# Altium project hv_psu_v100.PrjPcb
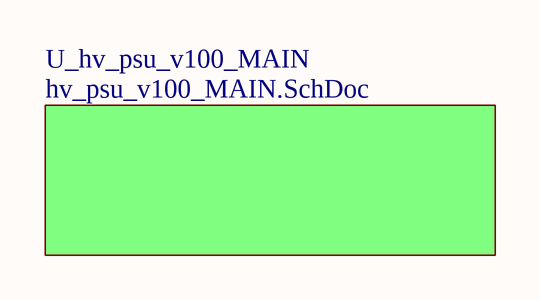
[diagram p0: hv_psu_v100_FRP.SchDoc]
7 sheets, 106 parts. Net scope: flat (ports and power ports of the same name join across sheets).
Board file: hv_psu_v100.PcbDoc
Sheets:
  hv_psu_v100_FRP.SchDoc
    U_hv_psu_v100_MAIN = hv_psu_v100_MAIN.SchDoc
      U_hv_psu_v100_FLYBACK = hv_psu_v100_FLYBACK.SchDoc
      U_hv_psu_v100_LINREG = hv_psu_v100_LINREG.SchDoc
      U_hv_psu_v100_MCU = hv_psu_v100_MCU.SchDoc
      U_hv_psu_v100_TESTLOAD = hv_psu_v100_TESTLOAD.SchDoc
      U_hv_psu_v100_CON = hv_psu_v100_CON.SchDoc

## Sheet hv_psu_v100_FRP.SchDoc
size A4; SheetNumber: 1; SheetTotal: 7

### Sub-sheets
U_hv_psu_v100_MAIN = hv_psu_v100_MAIN.SchDoc: no entries

## Sheet hv_psu_v100_MAIN.SchDoc
size A4; SheetNumber: 2; SheetTotal: 7
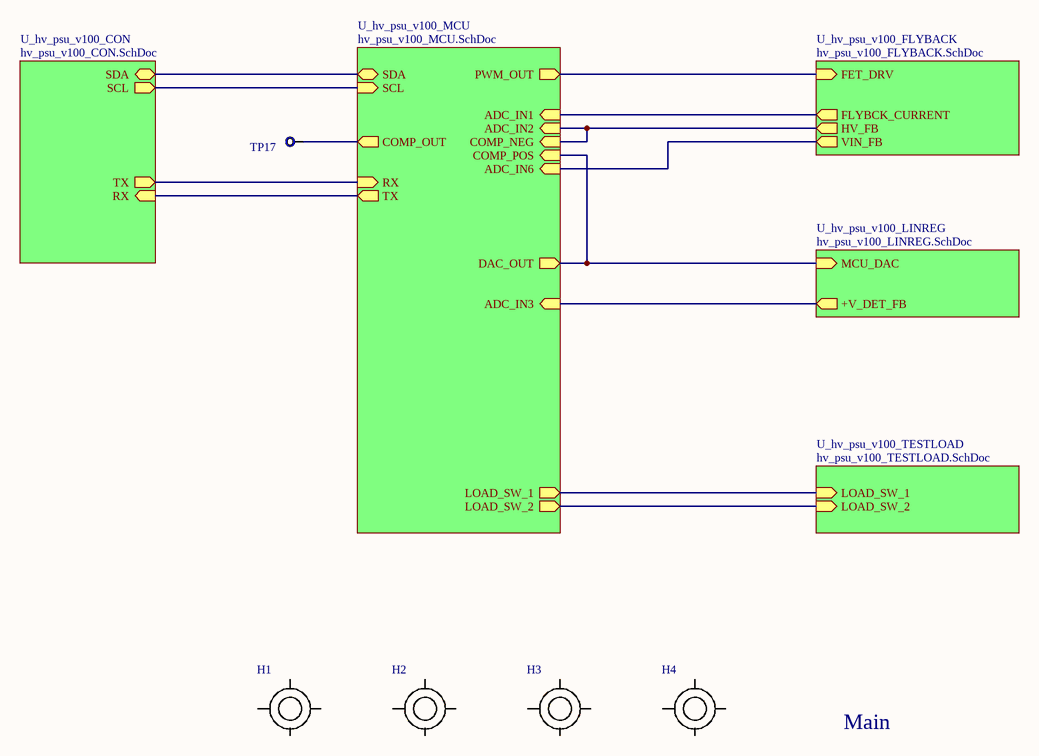
[diagram p1: hv_psu_v100_MAIN.SchDoc]

### Parts
H1  HOLE  [HOLE_140_160MIL]  (value not drawn)
H2  HOLE  [HOLE_140_160MIL]  (value not drawn)
H3  HOLE  [HOLE_140_160MIL]  (value not drawn)
H4  HOLE  [HOLE_140_160MIL]  (value not drawn)
TP17  ?  [PAD_40]  (value not drawn)  (no BOM)

### Sub-sheets
U_hv_psu_v100_CON = hv_psu_v100_CON.SchDoc: SDA (bidir), SCL (out), RX (in), TX (out)
U_hv_psu_v100_FLYBACK = hv_psu_v100_FLYBACK.SchDoc: FET_DRV (in), HV_FB (out), FLYBCK_CURRENT (out), VIN_FB (out)
U_hv_psu_v100_LINREG = hv_psu_v100_LINREG.SchDoc: MCU_DAC (in), +V_DET_FB (out)
U_hv_psu_v100_MCU = hv_psu_v100_MCU.SchDoc: SDA (bidir), SCL (in), ADC_IN1 (in), ADC_IN2 (in), COMP_NEG (in), ADC_IN3 (in), DAC_OUT (out), COMP_POS (in), PWM_OUT (out), LOAD_SW_1 (out), LOAD_SW_2 (out), COMP_OUT (out), ADC_IN6 (in), RX (in), TX (out)
U_hv_psu_v100_TESTLOAD = hv_psu_v100_TESTLOAD.SchDoc: LOAD_SW_1 (in), LOAD_SW_2 (in)

### Nets
NetTP17_1: TP17.1 ; sheet U_hv_psu_v100_MCU/COMP_OUT
(unnamed): sheet U_hv_psu_v100_FLYBACK/FET_DRV, sheet U_hv_psu_v100_MCU/PWM_OUT
(unnamed): sheet U_hv_psu_v100_FLYBACK/HV_FB, sheet U_hv_psu_v100_MCU/ADC_IN2, sheet U_hv_psu_v100_MCU/COMP_NEG
(unnamed): sheet U_hv_psu_v100_FLYBACK/FLYBCK_CURRENT, sheet U_hv_psu_v100_MCU/ADC_IN1
(unnamed): sheet U_hv_psu_v100_FLYBACK/VIN_FB, sheet U_hv_psu_v100_MCU/ADC_IN6
(unnamed): sheet U_hv_psu_v100_LINREG/MCU_DAC, sheet U_hv_psu_v100_MCU/DAC_OUT, sheet U_hv_psu_v100_MCU/COMP_POS
(unnamed): sheet U_hv_psu_v100_LINREG/+V_DET_FB, sheet U_hv_psu_v100_MCU/ADC_IN3
(unnamed): sheet U_hv_psu_v100_MCU/SDA, sheet U_hv_psu_v100_CON/SDA
(unnamed): sheet U_hv_psu_v100_MCU/SCL, sheet U_hv_psu_v100_CON/SCL
(unnamed): sheet U_hv_psu_v100_MCU/LOAD_SW_1, sheet U_hv_psu_v100_TESTLOAD/LOAD_SW_1
(unnamed): sheet U_hv_psu_v100_MCU/LOAD_SW_2, sheet U_hv_psu_v100_TESTLOAD/LOAD_SW_2
(unnamed): sheet U_hv_psu_v100_MCU/RX, sheet U_hv_psu_v100_CON/TX
(unnamed): sheet U_hv_psu_v100_MCU/TX, sheet U_hv_psu_v100_CON/RX

### Notes on the sheet
- Main

### Library data of the parts
TP17 = TESTPOINT

## Sheet hv_psu_v100_FLYBACK.SchDoc
size A4; SheetNumber: 4; SheetTotal: 7
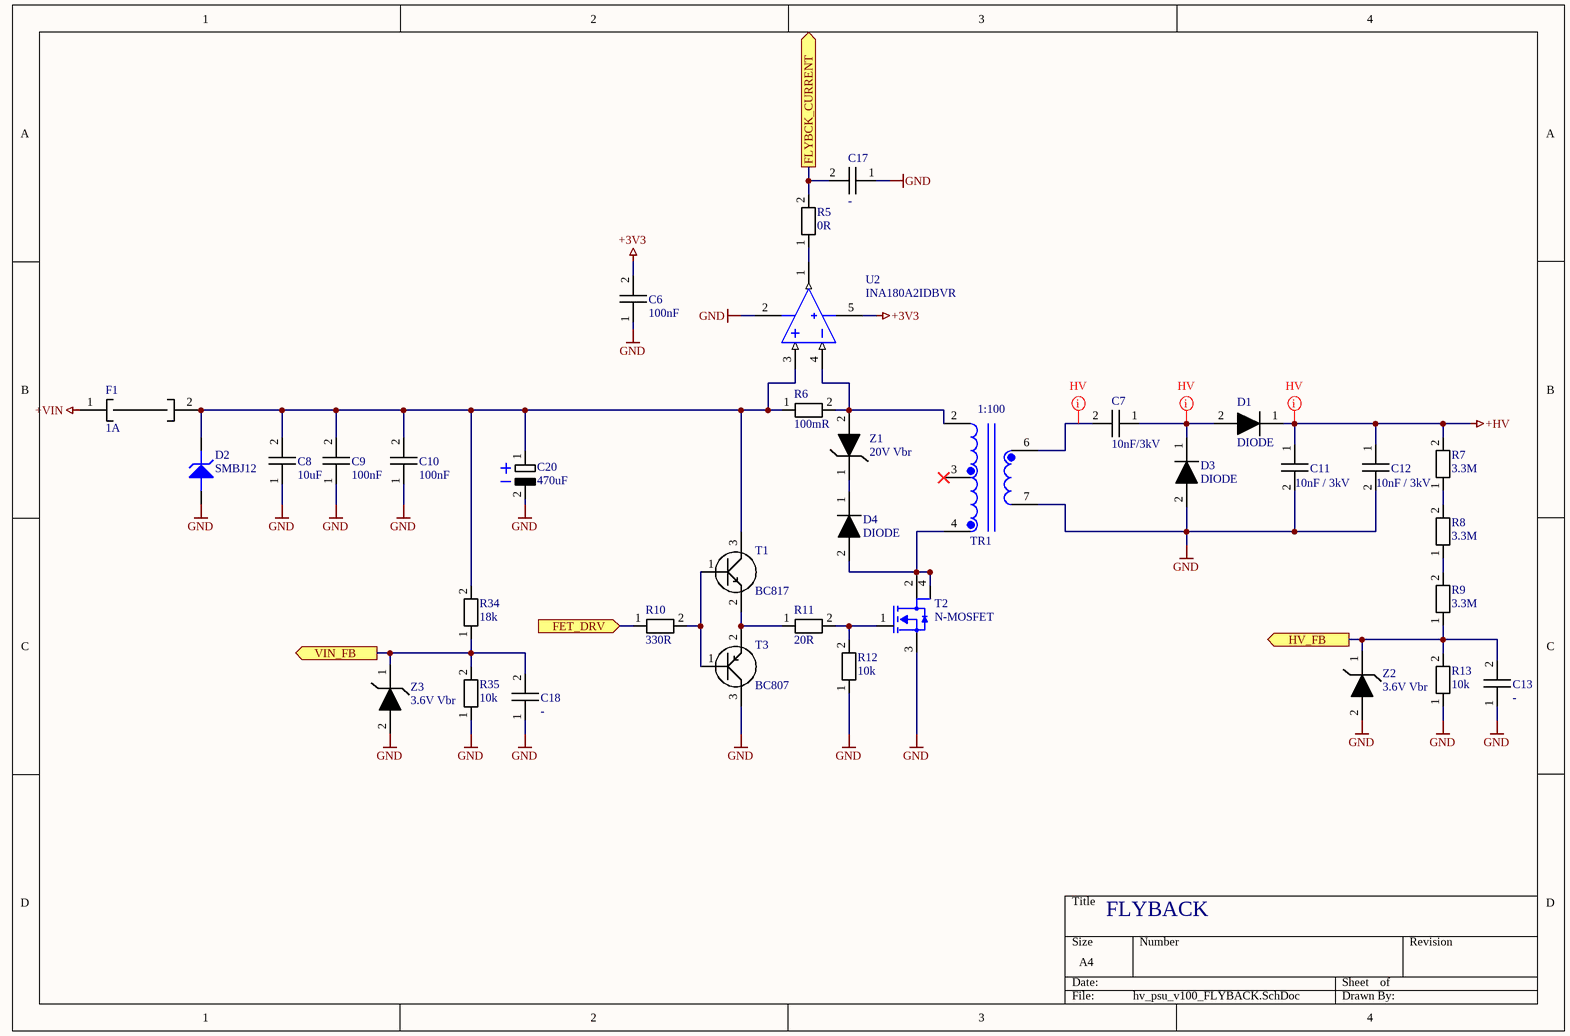
[diagram p2: hv_psu_v100_FLYBACK.SchDoc]

### Parts
C6  100nF  [1206_C]
C7  10nF/3kV  [2220_C]
C8  10uF  [1206_C]
C9  100nF  [1206_C]
C10  100nF  [1206_C]
C11  10nF / 3kV  [2220_C]
C12  10nF / 3kV  [2220_C]
C13  -  [1206_C]
C17  -  [1206_C]
C18  -  [1206_C]
C20  470uF  [CAPAE9383X110M]
D1  DIODE  [DIODE_400MIL]
D2  SMBJ12  [DO-214AA (SMB)]
D3  DIODE  [DIODE_400MIL]
D4  DIODE  [DIODE_400MIL]
F1  1A  [FUSE_1812L]
R5  0R  [1206]
R6  100mR  [1206]
R7  3.3M  [1206]
R8  3.3M  [1206]
R9  3.3M  [1206]
R10  330R  [1206]
R11  20R  [1206]
R12  10k  [1206]
R13  10k  [1206]
R34  18k  [1206]
R35  10k  [1206]
T1  BC817  [SOT23]
T2  N-MOSFET  [SOT233-1]
T3  BC807  [SOT23]
TR1  DARFON_CCFL_TRANSFORMER  [DARFON_CCFL_TRANSFORMER]  (value not drawn)
U2  INA180A2IDBVR  [SOT23-5]
Z1  20V Vbr  [SMD_DIODE_SOD80]
Z2  3.6V Vbr  [SMD_DIODE_SOD80]
Z3  3.6V Vbr  [SMD_DIODE_SOD80]

### Ports
FET_DRV (in), FLYBCK_CURRENT (out), HV_FB (out), VIN_FB (out)

### Nets
+3V3: C6.2 U2.5(V+)
+HV: C11.1 C12.1 D1.1 R7.2
+VIN: F1.1
GND: C6.1 C8.1 C9.1 C10.1 C11.2 C12.2 C13.1 C17.1 C18.1 C20.2 D2.A D3.2 R12.1 R13.1 R35.1 T2.3(S) T3.3 TR1.7 U2.2(V-) Z2.2 Z3.2
NetC7_1: C7.1 D1.2 D3.1
NetC7_2: C7.2 TR1.6
NetC8_2: C8.2 C9.2 C10.2 C20.1 D2.K F1.2 R6.1 R34.2 T1.3 U2.3(IN+)
NetC13_2: C13.2 R9.1 R13.2 Z2.1 ; port HV_FB
NetC17_2: C17.2 R5.2 ; port FLYBCK_CURRENT
NetC18_2: C18.2 R34.1 R35.2 Z3.1 ; port VIN_FB
NetD4_1: D4.1 Z1.1
NetD4_2: D4.2 T2.2(D) T2.4(D) TR1.4
NetR5_1: R5.1 U2.1(OUT)
NetR6_2: R6.2 TR1.2 U2.4(IN-) Z1.2
NetR7_1: R7.1 R8.2
NetR8_1: R8.1 R9.2
NetR10_1: R10.1 ; port FET_DRV
NetR10_2: R10.2 T1.1 T3.1
NetR11_1: R11.1 T1.2 T3.2
NetR11_2: R11.2 R12.2 T2.1(G)

Not connected (* = marked no-connect by the designer): TR1 3(2)*

### Layout directives
net class HV: +HV, NetC7_1, NetC7_2

### Notes on the sheet
- FLYBACK
- (in symbol DARFON_CCFL_TRANSFORMER) 1:100

### Library data of the parts
C6 C8-C10 C13 C17 C18 = CAPACITOR
C7 C11 C12 = CAPACITOR: Parameter 1: 2220HC103KAT1A
C20 = CAPACITOR_ELCO
D2 = DIODE_TVS
F1 = FUSE
R5-R11 R34 = RESISTOR: Parameter 1: 10k
R12 R13 R35 = RESISTOR: Parameter 1: 10k
T1 = TRANSISTOR_NPN
T2 = IRLL110: Power N-MOSFET 100V@1.5A 500mR 1.25W SOT223
T3 = TRANSISTOR_PNP
U2 = INA180A2IDBVR: Current Sense Amplifiers MULTI CHANNEL CURRENT SENSE L/H SIDE; Manufacturer_Name: Texas Instruments; Geometry.Height: 1.45mm; Mouser Part Number: 595-INA180A2IDBVR; Mouser Price/Stock: https://www.mouser.co.uk/ProductDetail/Texas-Instruments/INA180A2IDBVR?qs=5aG0NVq1C4wYcJfa99BoHg%3D%3D; Manufacturer_Part_Number: INA180A2IDBVR; Datasheet Link: http://www.ti.com/lit/ds/symlink/ina180.pdf
Z1-Z3 = DIODE_ZENER

## Sheet hv_psu_v100_LINREG.SchDoc
size A4; SheetNumber: 6; SheetTotal: 7
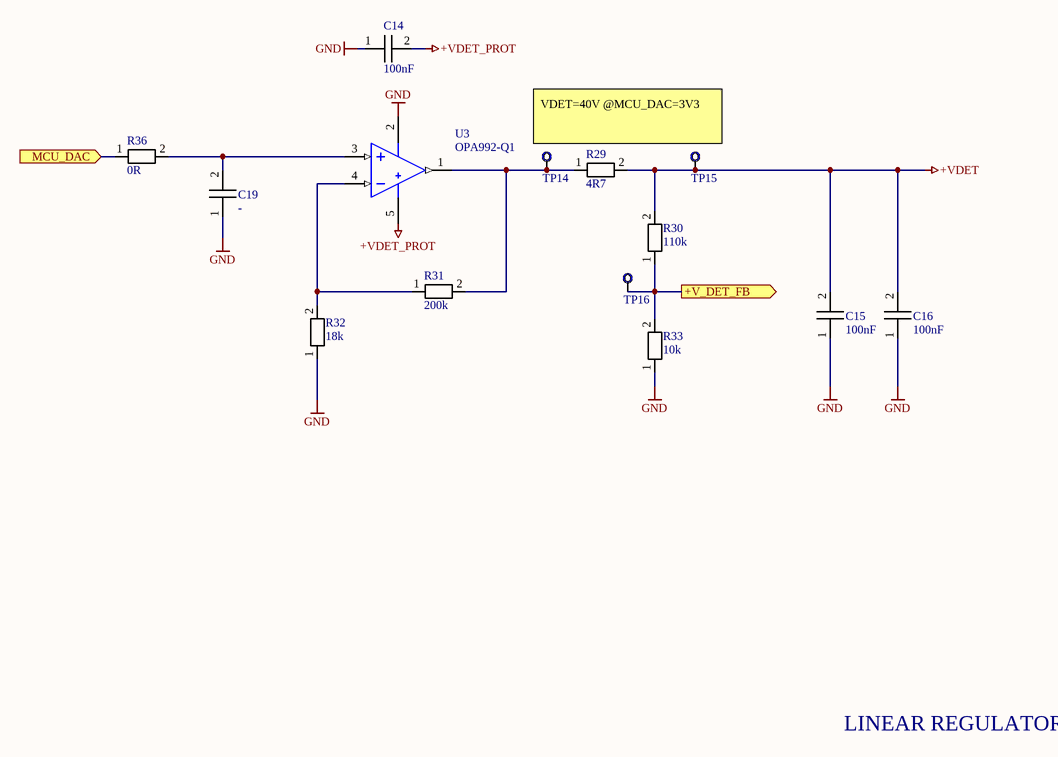
[diagram p3: hv_psu_v100_LINREG.SchDoc]

### Parts
C14  100nF  [1206_C]
C15  100nF  [1206_C]
C16  100nF  [1206_C]
C19  -  [1206_C]
R29  4R7  [1206]
R30  110k  [1206]
R31  200k  [1206]
R32  18k  [1206]
R33  10k  [1206]
R36  0R  [1206]
TP14  ?  [PAD_40]  (value not drawn)  (no BOM)
TP15  ?  [PAD_40]  (value not drawn)  (no BOM)
TP16  ?  [PAD_40]  (value not drawn)  (no BOM)
U3  OPA992-Q1  [SOT23-5]

### Ports
+V_DET_FB (out), MCU_DAC (in)

### Nets
+VDET: C15.2 C16.2 R29.2 R30.2 TP15.1
+VDET_PROT: C14.2 U3.5(V+)
GND: C14.1 C15.1 C16.1 C19.1 R32.1 R33.1 U3.2(V-)
NetC19_2: C19.2 R36.2 U3.3(IN+)
NetR29_1: R29.1 R31.2 TP14.1 U3.1(OUT)
NetR30_1: R30.1 R33.2 TP16.1 ; port +V_DET_FB
NetR31_1: R31.1 R32.2 U3.4(IN-)
NetR36_1: R36.1 ; port MCU_DAC

### Notes on the sheet
- VDET=40V @MCU_DAC=3V3
- LINEAR REGULATOR

### Library data of the parts
C14-C16 C19 = CAPACITOR
R29-R32 R36 = RESISTOR: Parameter 1: 10k
R33 = RESISTOR: Parameter 1: 10k
TP14-TP16 = TESTPOINT
U3 = OPA992-Q1: OPA992-Q1 Automotive, 40-V Rail-to-Rail Input or Output, / Low Offset Voltage, Low Noise Op Amp GBW 10.6MHz; Manufacturer_Name: Texas Instruments; Manufacturer_Part_Number: INA180A2IDBVR; Geometry.Height: 1.45mm; Mouser Part Number: 595-INA180A2IDBVR; Mouser Price/Stock: https://www.mouser.co.uk/ProductDetail/Texas-Instruments/INA180A2IDBVR?qs=5aG0NVq1C4wYcJfa99BoHg%3D%3D; Datasheet Link: http://www.ti.com/lit/ds/symlink/ina180.pdf

## Sheet hv_psu_v100_MCU.SchDoc
size A4; SheetNumber: 3; SheetTotal: 7
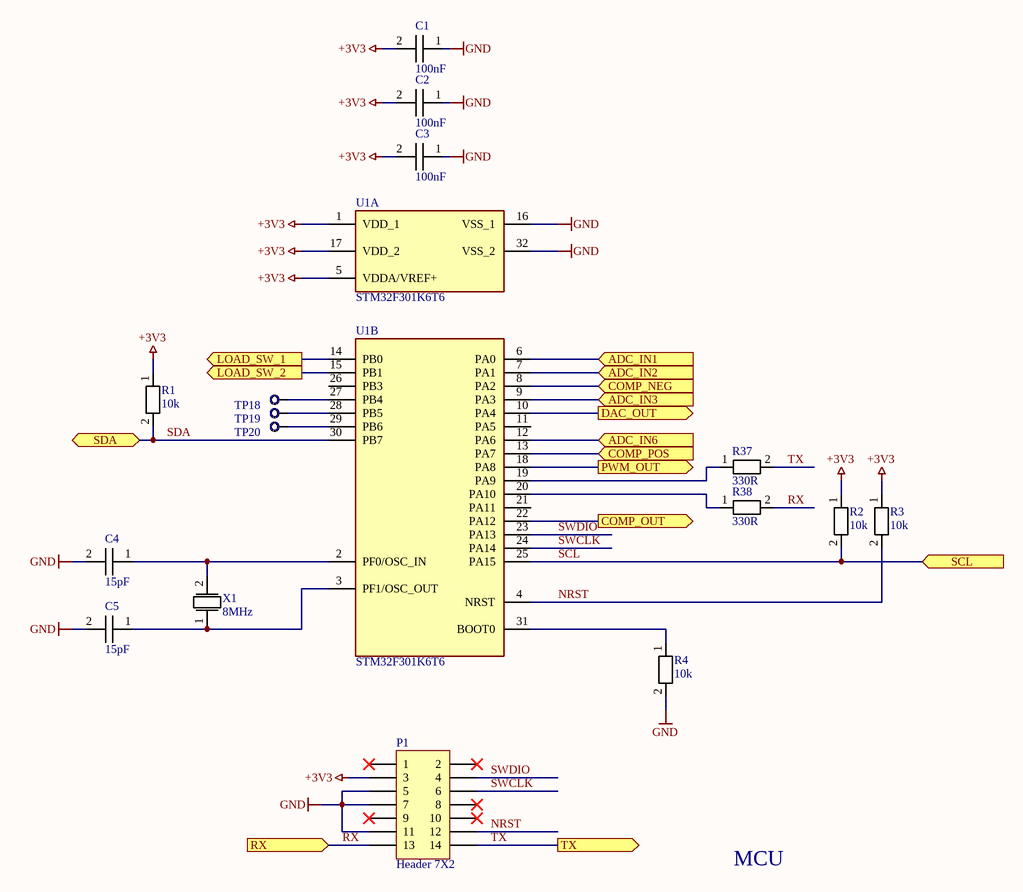
[diagram p4: hv_psu_v100_MCU.SchDoc]

### Parts
C1  100nF  [1206_C]
C2  100nF  [1206_C]
C3  100nF  [1206_C]
C4  15pF  [1206_C]
C5  15pF  [1206_C]
P1  Header 7X2  [HDR2X7]
R1  10k  [1206]
R2  10k  [1206]
R3  10k  [1206]
R4  10k  [1206]
R37  330R  [1206]
R38  330R  [1206]
TP18  ?  [PAD_40]  (value not drawn)  (no BOM)
TP19  ?  [PAD_40]  (value not drawn)  (no BOM)
TP20  ?  [PAD_40]  (value not drawn)  (no BOM)
U1  STM32F301K6T6  [QFP80P900X900X160-32N]  (parts A,B of 2)
X1  8MHz  [XTAL_SMALL]

### Ports
ADC_IN1 (in), ADC_IN2 (in), ADC_IN3 (in), ADC_IN6 (in), COMP_NEG (in), COMP_OUT (out), COMP_POS (in), DAC_OUT (out), LOAD_SW_1 (out), LOAD_SW_2 (out), PWM_OUT (out), RX (in), SCL (in), SDA (bidir), TX (out)

### Nets
+3V3: C1.2 C2.2 C3.2 P1.3 R1.1 R2.1 R3.1 U1.1(VDD_1) U1.5(VDDA/VREF+) U1.17(VDD_2)
GND: C1.1 C2.1 C3.1 C4.2 C5.2 P1.5 P1.7 P1.11 R4.2 U1.16(VSS_1) U1.32(VSS_2)
NRST: P1.12 R3.2 U1.4(NRST)
RX: P1.13 R38.2 ; port RX
SCL: R2.2 U1.25(PA15) ; port SCL
SDA: R1.2 U1.30(PB7) ; port SDA
SWCLK: P1.6 U1.24(PA14)
SWDIO: P1.4 U1.23(PA13)
TX: P1.14 R37.2 ; port TX
NetC4_1: C4.1 U1.2(PF0/OSC_IN) X1.2
NetC5_1: C5.1 U1.3(PF1/OSC_OUT) X1.1
NetR4_1: R4.1 U1.31(BOOT0)
NetR23_2: U1.14(PB0) ; port LOAD_SW_1
NetR24_2: U1.15(PB1) ; port LOAD_SW_2
NetR37_1: R37.1 U1.19(PA9)
NetR38_1: R38.1 U1.20(PA10)
NetTP18_1: TP18.1 U1.27(PB4)
NetTP19_1: TP19.1 U1.28(PB5)
NetTP20_1: TP20.1 U1.29(PB6)
NetU1_6: U1.6(PA0) ; port ADC_IN1
NetU1_7: U1.7(PA1) ; port ADC_IN2
NetU1_8: U1.8(PA2) ; port COMP_NEG
NetU1_9: U1.9(PA3) ; port ADC_IN3
NetU1_10: U1.10(PA4) ; port DAC_OUT
NetU1_12: U1.12(PA6) ; port ADC_IN6
NetU1_13: U1.13(PA7) ; port COMP_POS
NetU1_18: U1.18(PA8) ; port PWM_OUT
NetU1_22: U1.22(PA12) ; port COMP_OUT

Not connected (* = marked no-connect by the designer): P1 1* 2* 8* 9* 10*; U1 11(PA5) 21(PA11) 26(PB3)

### Notes on the sheet
- MCU

### Library data of the parts
C1-C5 = CAPACITOR
P1 = Header 7X2: Header, 7-Pin, Dual row; LatestRevisionDate: 17-Jul-2002; LatestRevisionNote: Re-released for DXP Platform.; Publisher: Altium Limited
R1-R4 = RESISTOR: Parameter 1: 10k
R37 R38 = RESISTOR: Parameter 1: 10k
TP18-TP20 = TESTPOINT
U1 = STM32F301K6T6: ARM Microcontrollers - MCU Mainstream Mixed signals MCUs ARM Cortex-M4 core with DSP and FPU, 64 Kbytes Flash, 72 MHz CPU, 12-bit ADC 5 MSPS, Comparator, Op-Amp; Manufacturer_Name: STMicroelectronics; Geometry.Height: 1.6mm; Manufacturer_Part_Number: STM32F301K6T6; Mouser Part Number: 511-STM32F301K6T6; Mouser Price/Stock: https://www.mouser.co.uk/ProductDetail/STMicroelectronics/STM32F301K6T6?qs=lYGu3FyN48diEpbf2nZa%2Fg%3D%3D; Arrow Part Number: STM32F301K6T6; Arrow Price/Stock: https://www.arrow.com/en/products/stm32f301k6t6/stmicroelectronics; Datasheet Link: https://componentsearchengine.com/Datasheets/1/STM32F301K6T6.pdf
X1 = XTAL

## Sheet hv_psu_v100_TESTLOAD.SchDoc
size A4; SheetNumber: 5; SheetTotal: 7
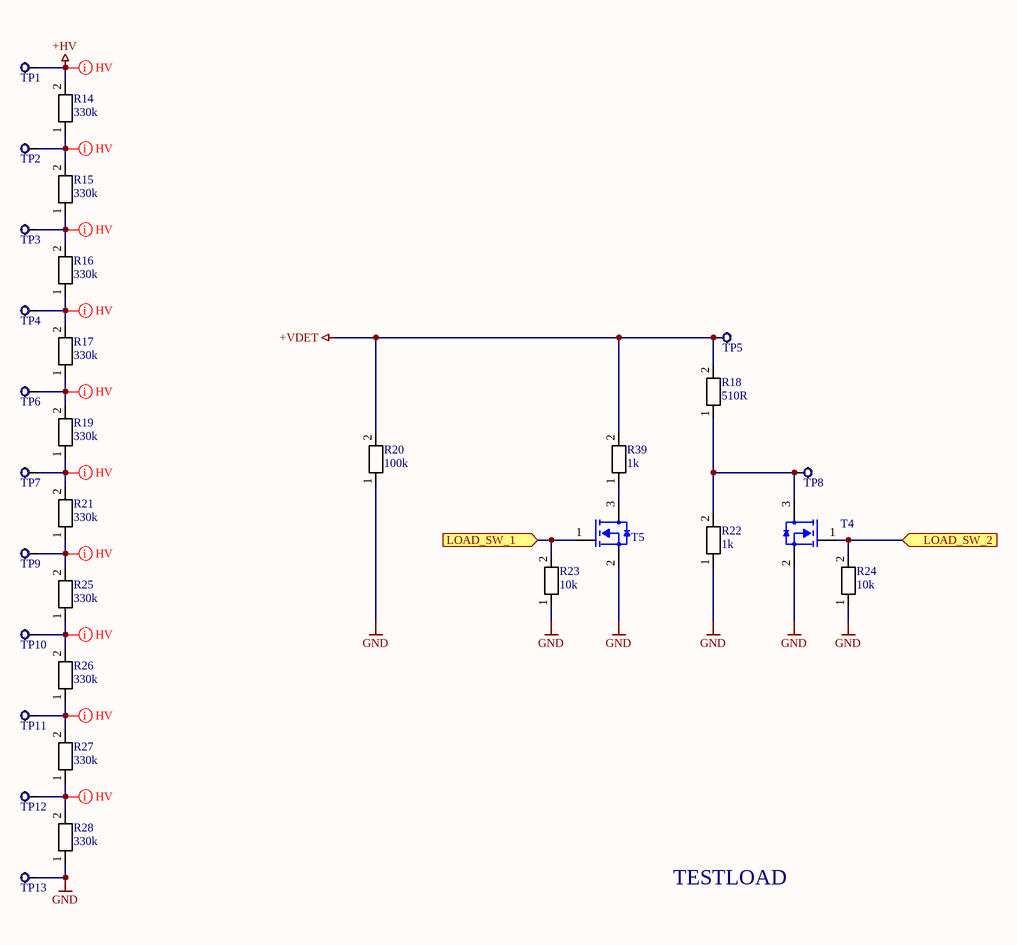
[diagram p5: hv_psu_v100_TESTLOAD.SchDoc]

### Parts
R14  330k  [1206]
R15  330k  [1206]
R16  330k  [1206]
R17  330k  [1206]
R18  510R  [1206]
R19  330k  [1206]
R20  100k  [1206]
R21  330k  [1206]
R22  1k  [1206]
R23  10k  [1206]
R24  10k  [1206]
R25  330k  [1206]
R26  330k  [1206]
R27  330k  [1206]
R28  330k  [1206]
R39  1k  [1206]
T4  MMBF170  [SOT23]  (value not drawn)
T5  MMBF170  [SOT23]  (value not drawn)
TP1  ?  [PAD_40]  (value not drawn)  (no BOM)
TP2  ?  [PAD_40]  (value not drawn)  (no BOM)
TP3  ?  [PAD_40]  (value not drawn)  (no BOM)
TP4  ?  [PAD_40]  (value not drawn)  (no BOM)
TP5  ?  [PAD_40]  (value not drawn)  (no BOM)
TP6  ?  [PAD_40]  (value not drawn)  (no BOM)
TP7  ?  [PAD_40]  (value not drawn)  (no BOM)
TP8  ?  [PAD_40]  (value not drawn)  (no BOM)
TP9  ?  [PAD_40]  (value not drawn)  (no BOM)
TP10  ?  [PAD_40]  (value not drawn)  (no BOM)
TP11  ?  [PAD_40]  (value not drawn)  (no BOM)
TP12  ?  [PAD_40]  (value not drawn)  (no BOM)
TP13  ?  [PAD_40]  (value not drawn)  (no BOM)

### Ports
LOAD_SW_1 (in), LOAD_SW_2 (in)

### Nets
+HV: R14.2 TP1.1
+VDET: R18.2 R20.2 R39.2 TP5.1
GND: R20.1 R22.1 R23.1 R24.1 R28.1 T4.2(Source) T5.2(Source) TP13.1
NetR14_1: R14.1 R15.2 TP2.1
NetR15_1: R15.1 R16.2 TP3.1
NetR16_1: R16.1 R17.2 TP4.1
NetR17_1: R17.1 R19.2 TP6.1
NetR18_1: R18.1 R22.2 T4.3(Drain) TP8.1
NetR19_1: R19.1 R21.2 TP7.1
NetR21_1: R21.1 R25.2 TP9.1
NetR23_2: R23.2 T5.1(Gate) ; port LOAD_SW_1
NetR24_2: R24.2 T4.1(Gate) ; port LOAD_SW_2
NetR25_1: R25.1 R26.2 TP10.1
NetR26_1: R26.1 R27.2 TP11.1
NetR27_1: R27.1 R28.2 TP12.1
NetR39_1: R39.1 T5.3(Drain)

### Layout directives
net class HV: +HV, NetR14_1, NetR15_1, NetR16_1, NetR17_1, NetR19_1, NetR21_1, NetR25_1, NetR26_1, NetR27_1

### Notes on the sheet
- TESTLOAD

### Library data of the parts
R14-R22 R25-R28 R39 = RESISTOR: Parameter 1: 10k
R23 R24 = RESISTOR: Parameter 1: 10k
T4 T5 = MMBF170: N MOSFET
TP1-TP13 = TESTPOINT

## Sheet hv_psu_v100_CON.SchDoc
size A4; SheetNumber: 7; SheetTotal: 7
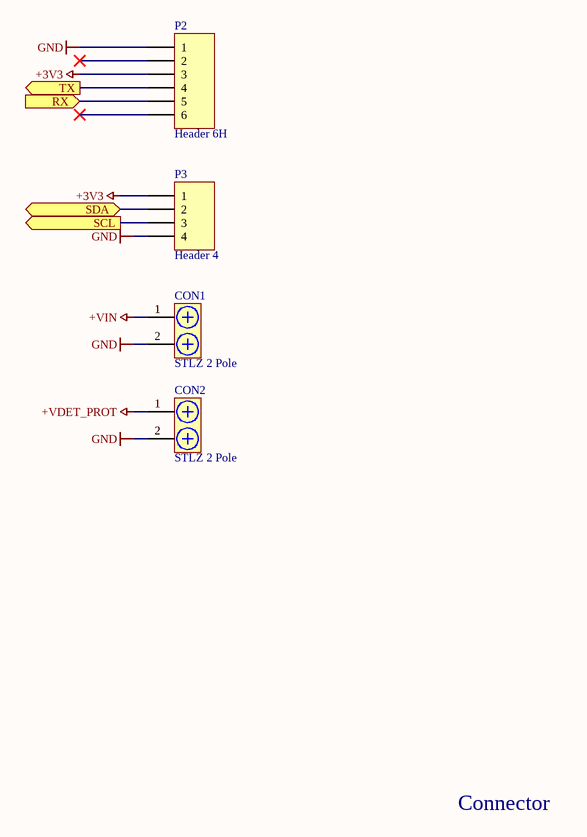
[diagram p6: hv_psu_v100_CON.SchDoc]

### Parts
CON1  STLZ 2 Pole  [CON_STLZ_950WV2 + AKZ 950/2]
CON2  STLZ 2 Pole  [CON_STLZ_950WV2 + AKZ 950/2]
P2  Header 6H  [HDR1X6H]
P3  Header 4  [HDR1X4]

### Ports
RX (in), SCL (out), SDA (bidir), TX (out)

### Nets
+3V3: P2.3 P3.1
+VDET_PROT: CON2.1
+VIN: CON1.1
GND: CON1.2 CON2.2 P2.1 P3.4
RX: P2.5 ; port RX
SCL: P3.3 ; port SCL
SDA: P3.2 ; port SDA
TX: P2.4 ; port TX

Not connected (* = marked no-connect by the designer): P2 2* 6*

### Notes on the sheet
- Connector

### Library data of the parts
P2 = Header 6H: Header, 6-Pin, Right Angle; LatestRevisionDate: 17-Jul-2002; LatestRevisionNote: Re-released for DXP Platform.; Publisher: Altium Limited
P3 = Header 4: Header, 4-Pin; LatestRevisionDate: 17-Jul-2002; LatestRevisionNote: Re-released for DXP Platform.; Publisher: Altium Limited

## Nets that join several sheets
+3V3: hv_psu_v100_FLYBACK (C6.2 U2.5), hv_psu_v100_MCU (10 pins), hv_psu_v100_CON (P2.3 P3.1)
+HV: hv_psu_v100_FLYBACK (C11.1 C12.1 D1.1 R7.2), hv_psu_v100_TESTLOAD (R14.2 TP1.1)
+VDET: hv_psu_v100_LINREG (5 pins), hv_psu_v100_TESTLOAD (R18.2 R20.2 R39.2 TP5.1)
+VDET_PROT: hv_psu_v100_LINREG (C14.2 U3.5), hv_psu_v100_CON (CON2.1)
+VIN: hv_psu_v100_FLYBACK (F1.1), hv_psu_v100_CON (CON1.1)
GND: hv_psu_v100_FLYBACK (21 pins), hv_psu_v100_LINREG (7 pins), hv_psu_v100_MCU (11 pins), hv_psu_v100_TESTLOAD (8 pins), hv_psu_v100_CON (CON1.2 CON2.2 P2.1 P3.4)
NetR23_2: hv_psu_v100_MCU (U1.14), hv_psu_v100_TESTLOAD (R23.2 T5.1)
NetR24_2: hv_psu_v100_MCU (U1.15), hv_psu_v100_TESTLOAD (R24.2 T4.1)
RX: hv_psu_v100_MCU (P1.13 R38.2), hv_psu_v100_CON (P2.5)
SCL: hv_psu_v100_MCU (R2.2 U1.25), hv_psu_v100_CON (P3.3)
SDA: hv_psu_v100_MCU (R1.2 U1.30), hv_psu_v100_CON (P3.2)
TX: hv_psu_v100_MCU (P1.14 R37.2), hv_psu_v100_CON (P2.4)